# EAGLE design arduino-scratch-a (EAGLE 9.7.0)
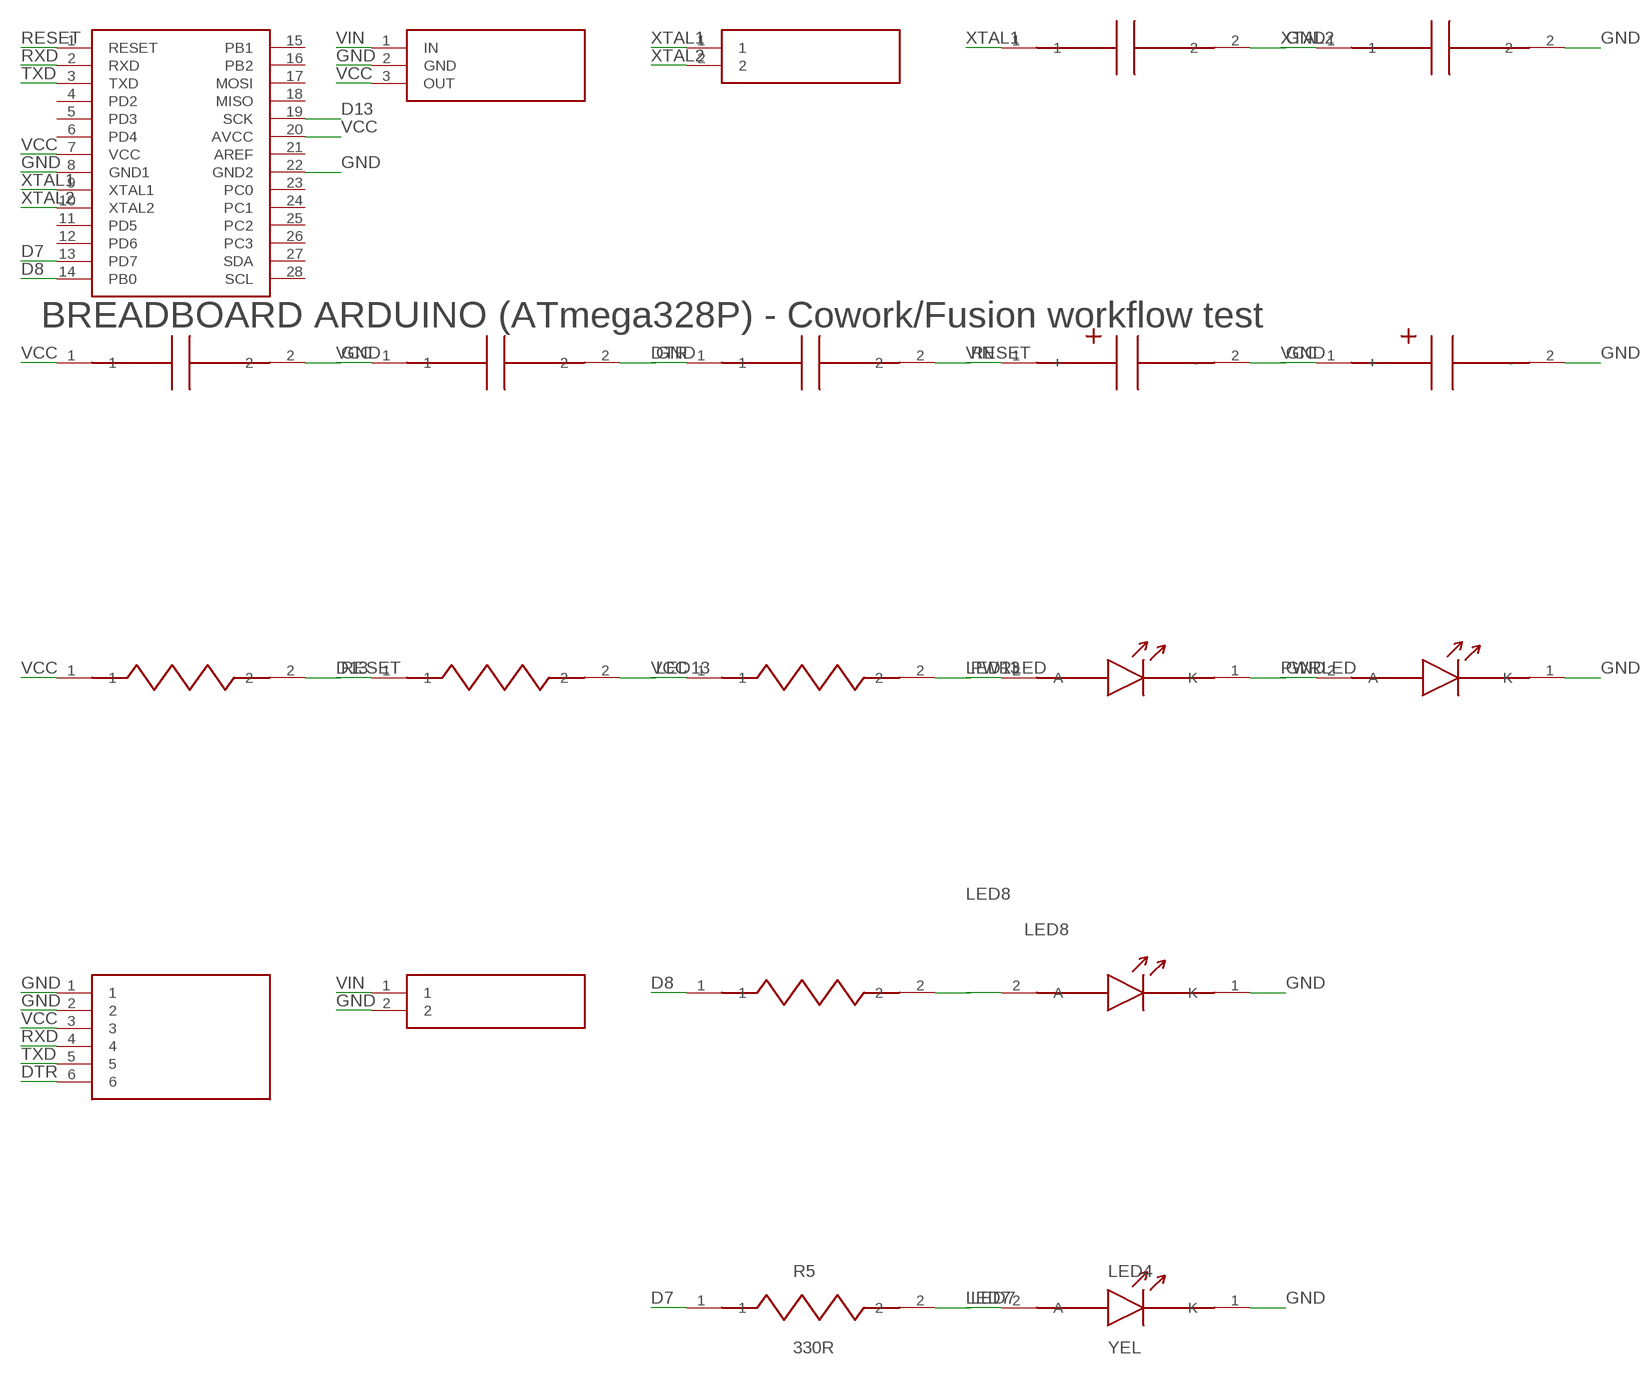
[diagram p0: schematic, sheet 1]

## Parts
C1  22P  CAP  [C_DISC]
C2  22P  CAP  [C_DISC]
C3  100N  CAP  [C_DISC]
C4  100N  CAP  [C_DISC]
C5  100N  CAP  [C_DISC]
C6  10U  CAPP  [CP_RADIAL]
C7  10U  CAPP  [CP_RADIAL]
J1  FTDI  HDR6  [HDR6]
J2  7-12V DC  HDR2  [HDR2]
LED1  YEL  LED  [LED5]
LED2  GRN  LED  [LED5]
LED3  YEL  LED  [LED5]
LED4  YEL  LED  [LED5]
R1  10K  RES  [R_AXIAL]
R2  330R  RES  [R_AXIAL]
R3  1K  RES  [R_AXIAL]
R4  330R  RES  [R_AXIAL]
R5  330R  RES  [R_AXIAL]
U1  ATMEGA328P-PU  ATMEGA328  [DIP28N]
U2  7805  L7805  [TO220]
Y1  16MHZ  XTAL16  [HC49]

## Nets
D7: R5.1 U1.13(PD7)
D8: R4.1 U1.14(PB0)
D13: R2.1 U1.19(SCK)
DTR: C5.1 J1.6
GND: C1.2 C2.2 C3.2 C4.2 C6.2(-) C7.2(-) J1.1 J1.2 J2.2 LED1.1(K) LED2.1(K) LED3.1(K) LED4.1(K) U1.8(GND1) U1.22(GND2) U2.2(GND)
LED7: LED4.2(A) R5.2
LED8: LED3.2(A) R4.2
LED13: LED1.2(A) R2.2
PWRLED: LED2.2(A) R3.2
RESET: C5.2 R1.2 U1.1(RESET)
RXD: J1.4 U1.2(RXD)
TXD: J1.5 U1.3(TXD)
VCC: C3.1 C4.1 C7.1(+) J1.3 R1.1 R3.1 U1.7(VCC) U1.20(AVCC) U2.3(OUT)
VIN: C6.1(+) J2.1 U2.1(IN)
XTAL1: C1.1 U1.9(XTAL1) Y1.1
XTAL2: C2.1 U1.10(XTAL2) Y1.2
Unconnected: U1.4(PD2) U1.5(PD3) U1.6(PD4) U1.11(PD5) U1.12(PD6) U1.15(PB1) U1.16(PB2) U1.17(MOSI) U1.18(MISO) U1.21(AREF) U1.23(PC0) U1.24(PC1) U1.25(PC2) U1.26(PC3) U1.27(SDA) U1.28(SCL)

## Notes on the sheet
- BREADBOARD ARDUINO (ATmega328P) - Cowork/Fusion workflow test

## Library data of the parts
C1-C5 = p8x:CAP
C6 C7 = p8x:CAPP
J1 = p8x:HDR6
J2 = p8x:HDR2
LED1-LED4 = p8x:LED
R1-R5 = p8x:RES
U1 = p8x:ATMEGA328
U2 = p8x:L7805
Y1 = p8x:XTAL16

## Board
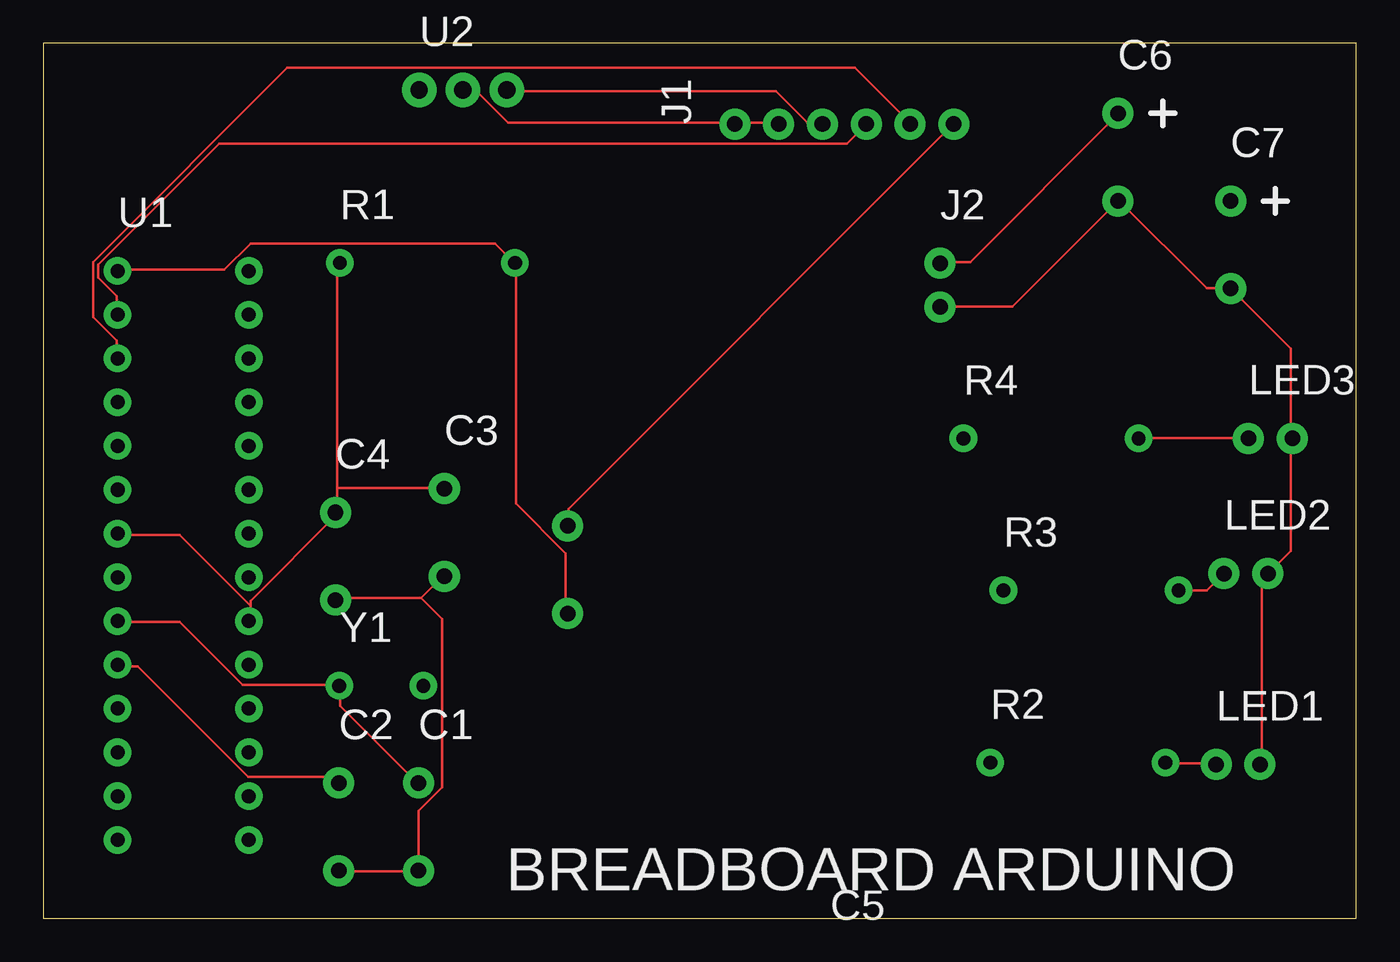
[diagram p1: board, top side]
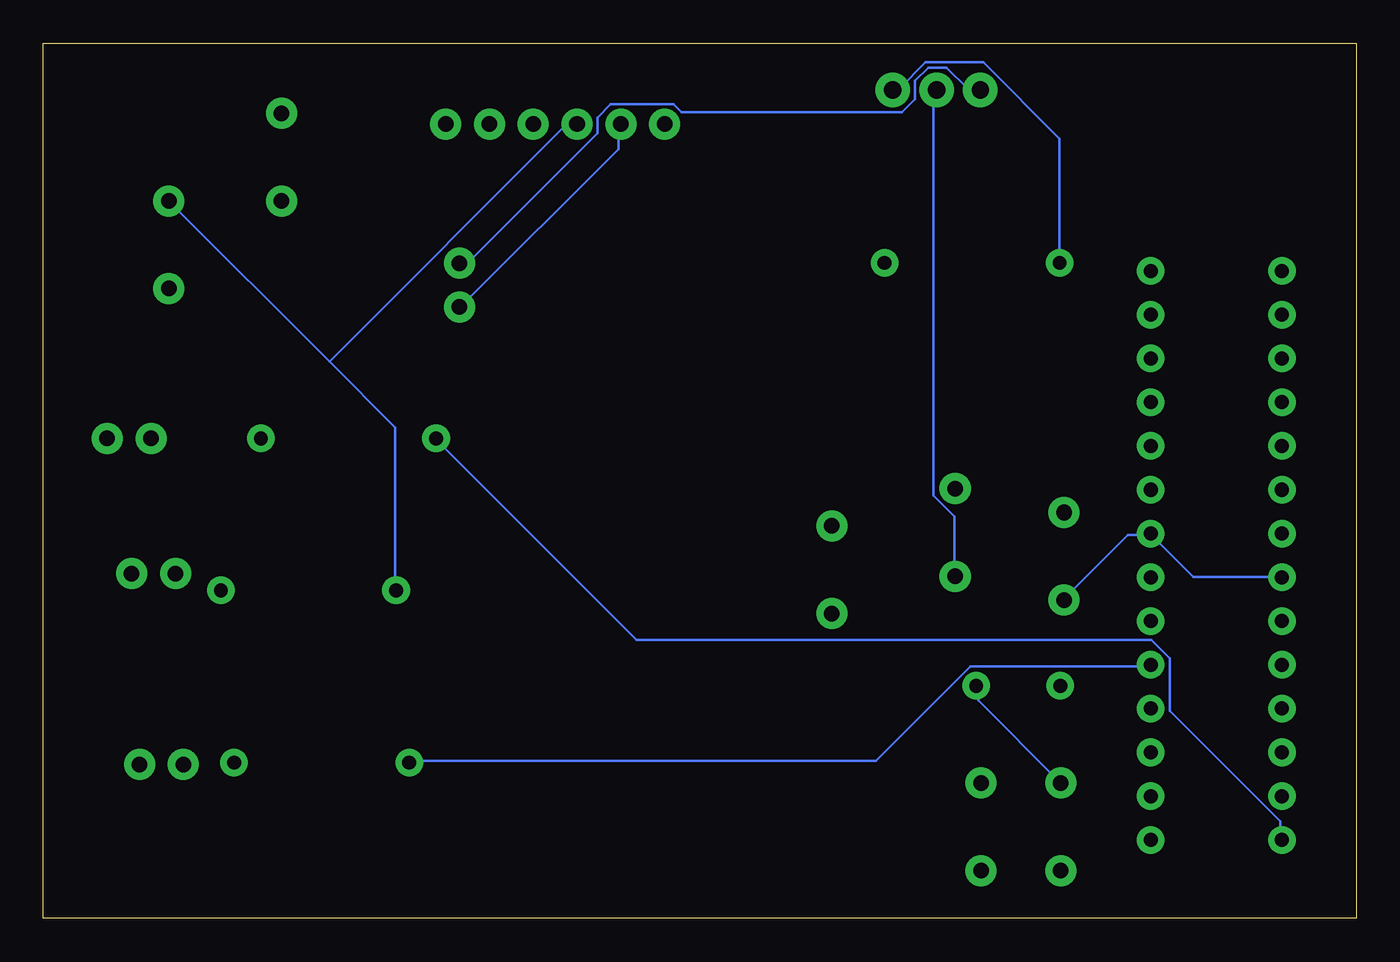
[diagram p2: board, bottom side, seen from below]

Size 76.2 x 50.8 mm. Coordinates in mm from the lower left corner, seen from the top.
Outline: 0,0 76.2,0 76.2,50.8 0,50.8 0,0
Copper layers (1*2*15*16): Top 0.035mm / dielectric 1.5mm / Route2 0.035mm / dielectric 0.15mm / Route15 0.035mm / dielectric 0.2mm / Bottom 0.035mm
Design rules "Fusion Electronics Design Rules": minimum track width 6mil, minimum drill 0.35mm, track to track 6mil, track to pad 6mil, pad to pad 6mil, via to via 6mil, smd to smd 6mil, copper to edge 40mil, drill to drill 6mil, minimum pad ring 10mil, minimum via ring 8mil, stop-mask expansion 4mil, vias tented up to drill 9999mil, thermal gap 10mil

### Footprints (pad centres in the part's own frame; a part is rotated, then mirrored left to right if it is on the bottom)
C_DISC = drill 0.9 pad 1.8: 1 0,0; 2 0,-5.08
CP_RADIAL = drill 0.9 pad 1.8: 1 0,0; 2 0,-5.08
HDR6 = drill 0.9 pad 1.8: 1 0,0; 2 0,-2.54; 3 0,-5.08; 4 0,-7.62; 5 0,-10.16; 6 0,-12.7
HDR2 = drill 0.9 pad 1.8: 1 0,0; 2 0,-2.54
LED5 = drill 0.9 pad 1.8: 1 2.54,0; 2 0,0
R_AXIAL = drill 0.8 pad 1.6: 1 0,0; 2 10.16,0
DIP28N = drill 0.813 pad 1.6: 1 0,0; 2 0,-2.54; 3 0,-5.08; 4 0,-7.62; 5 0,-10.16; 6 0,-12.7; 7 0,-15.24; 8 0,-17.78; 9 0,-20.32; 10 0,-22.86; 11 0,-25.4; 12 0,-27.94; 13 0,-30.48; 14 0,-33.02; 15 7.62,-33.02; 16 7.62,-30.48; 17 7.62,-27.94; 18 7.62,-25.4; 19 7.62,-22.86; 20 7.62,-20.32; 21 7.62,-17.78; 22 7.62,-15.24; 23 7.62,-12.7; 24 7.62,-10.16; 25 7.62,-7.62; 26 7.62,-5.08; 27 7.62,-2.54; 28 7.62,0
TO220 = drill 1 pad 2: 1 0,0; 2 2.54,0; 3 5.08,0
HC49 = drill 0.8 pad 1.6: 1 0,0; 2 4.88,0

### Placement (x,y rotation side)
C1  21.78,7.86 0 top
C2  17.16,7.86 0 top
C3  23.28,24.94 0 top
C4  16.96,23.56 0 top
C5  30.44,22.78 0 top
C6  62.36,46.72 0 top
C7  68.9,41.64 0 top
J1  40.14,46.1 90 top
J2  52.04,38.02 0 top
LED1  68.06,8.94 0 top
LED2  68.52,20.02 0 top
LED3  69.94,27.86 0 top
LED4  100,10 0 top  (outside the outline)
R1  17.22,38.04 0 top
R2  54.96,9.04 0 top
R3  55.72,19.04 0 top
R4  53.4,27.86 0 top
R5  85,10 0 top  (outside the outline)
U1  4.32,37.58 0 top
U2  21.82,48.08 0 top
Y1  17.18,13.5 0 top

### Tracks (layer width: path | path; a pad name or v marks a point on that pad's centre or on a via)
D8
  Bottom 0.152: U1.14 4.42,4.57 4.42,5.64 10.82,12.04 10.82,15.09 11.89,16.15 41.76,16.15 53.34,27.74 R4.1
D13
  Bottom 0.152: R2.1 54.86,9.14 27.89,9.14 22.4,14.63 12.04,14.63 U1.19
DTR
  Top 0.152: C5.1 30.48,22.86 30.48,23.77 52.73,46.02 J1.6
GND
  Top 0.152: C2.2 17.22,2.74 21.64,2.74 C1.2 21.79,2.9 21.79,6.25 23.16,7.62 23.16,17.37 21.95,18.59 | 21.95,18.59 17.07,18.59 C4.2 | 21.95,18.59 23.16,19.81 C3.2 | J1.2 42.67,46.18 40.23,46.18 J1.1 40.08,46.18 26.98,46.18 25.15,48.01 24.38,48.01 U2.2 | LED1.1 70.71,8.99 70.71,19.66 71.02,19.96 LED2.1 71.17,20.12 72.39,21.34 72.39,27.74 LED3.1 72.39,27.89 72.39,33.07 69.04,36.42 C7.2 68.89,36.58 67.51,36.58 62.48,41.6 C6.2 62.33,41.6 56.24,35.51 52.12,35.51 J2.2
  Bottom 0.152: U1.8 4.42,19.81 9.45,19.81 11.89,22.25 U1.22 12.04,22.25 13.26,22.25 16.92,18.59 C4.2 | J1.2 42.82,46.02 42.82,44.65 51.97,35.51 J2.2 | C3.2 23.32,19.96 23.32,23.32 24.54,24.54 24.54,47.85 24.38,48.01 U2.2
LED8
  Top 0.152: R4.2 63.7,27.89 69.8,27.89 LED3.2
LED13
  Top 0.152: R2.2 65.23,8.99 67.97,8.99 LED1.2
PWRLED
  Top 0.152: R3.2 65.99,19.05 67.51,19.05 68.43,19.96 LED2.2
RESET
  Top 0.152: U1.1 4.42,37.64 10.52,37.64 12.04,39.17 26.21,39.17 27.28,38.1 R1.2 27.43,37.95 27.43,24.08 30.33,21.18 30.33,17.83 C5.2
RXD
  Top 0.152: U1.2 4.27,35.05 4.27,36.12 3.2,37.19 3.2,37.95 10.21,44.96 46.63,44.96 47.7,46.02 J1.4
TXD
  Top 0.152: U1.3 4.27,32.61 4.27,33.53 2.9,34.9 2.9,38.1 14.17,49.38 47.09,49.38 50.29,46.18 J1.5
VCC
  Top 0.152: J1.3 45.11,46.18 44.35,46.18 42.52,48.01 26.98,48.01 U2.3 | 12.04,18.14 12.04,18.44 17.07,23.47 C4.1 17.07,23.62 17.07,24.99 | 12.04,18.14 12.04,17.37 U1.20 | 12.04,18.14 7.92,22.25 4.42,22.25 U1.7 | 17.07,24.99 17.07,37.95 R1.1 | 17.07,24.99 23.16,24.99 C3.1
  Bottom 0.152: 59.59,32.31 68.89,41.6 C7.1 | 59.59,32.31 55.78,28.5 55.78,19.05 R3.1 | U2.3 26.82,48.16 26.52,48.16 24.99,49.68 21.64,49.68 17.22,45.26 17.22,38.1 R1.1 | 59.59,32.31 45.87,46.02 45.26,46.02 J1.3
VIN
  Top 0.152: J2.1 52.12,38.1 53.8,38.1 62.33,46.63 C6.1
  Bottom 0.152: U2.1 21.95,48.16 22.55,48.16 23.77,49.38 24.84,49.38 25.6,48.62 25.6,47.55 26.36,46.79 39.17,46.79 39.62,47.24 43.28,47.24 44.04,46.48 44.04,45.57 51.51,38.1 51.97,38.1 J2.1
XTAL1
  Top 0.152: C1.1 21.64,7.92 17.22,12.34 17.22,13.41 Y1.1 17.07,13.56 11.58,13.56 7.92,17.22 4.42,17.22 U1.9
XTAL2
  Top 0.152: U1.10 4.42,14.63 5.49,14.63 11.89,8.23 16.76,8.23 17.07,7.92 C2.1
  Bottom 0.152: Y1.2 21.95,13.41 21.95,12.65 17.22,7.92 C2.1

### Text on the board
tPlace: BREADBOARD ARDUINO